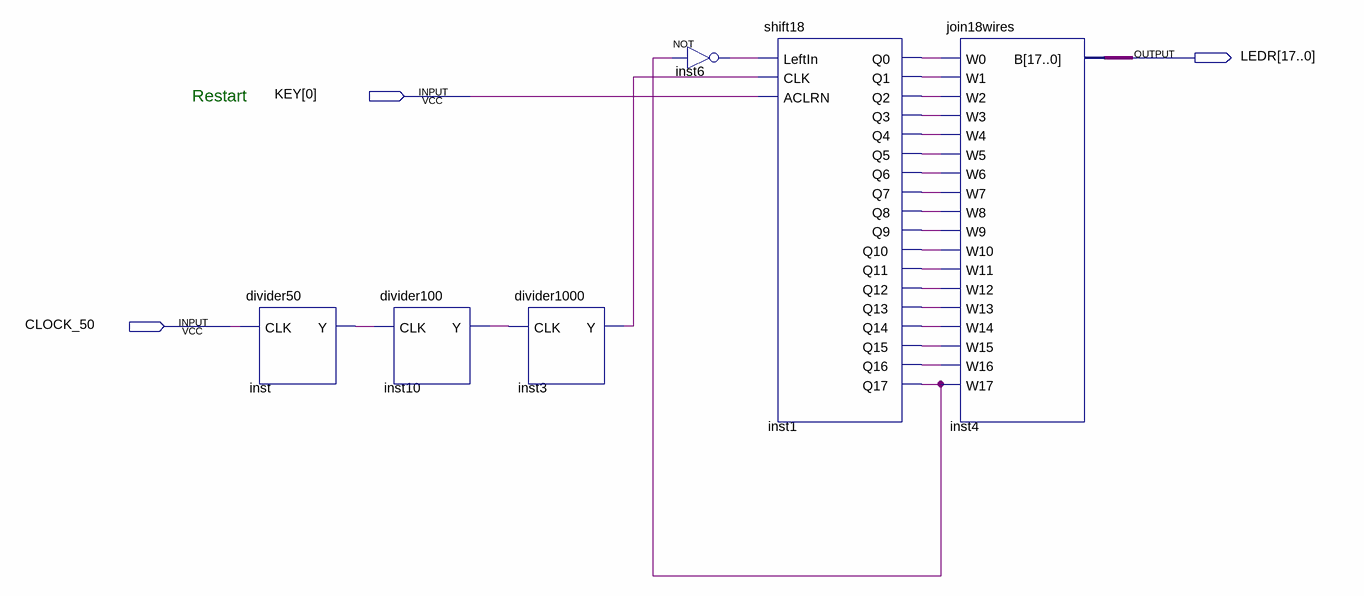
[diagram p0: schematic sheet]
// Quartus schematic test_shift18.bdf as structural Verilog: 6 symbols, 3 pins
module test_shift18 (
  input  [0:0] KEY,
  input  CLOCK_50,
  output [17:0] LEDR
);

  wire inst1_q0, inst1_q1, inst1_q2, inst1_q3, inst1_q4, inst1_q5, inst1_q6, inst1_q7, inst1_q8, inst1_q9,
       inst1_q10, inst1_q11, inst1_q12, inst1_q13, inst1_q14, inst1_q15, inst1_q16, inst1_q17, inst3_y,
       inst6_out, inst10_y, inst_y;

  divider50 inst (.CLK(CLOCK_50), .Y(inst_y));
  divider100 inst10 (.CLK(inst_y), .Y(inst10_y));
  divider1000 inst3 (.CLK(inst10_y), .Y(inst3_y));
  not inst6 (inst6_out, inst1_q17);
  shift18 inst1 (
    .LeftIn(inst6_out), .CLK(inst3_y), .ACLRN(KEY[0]), .Q0(inst1_q0), .Q1(inst1_q1), .Q2(inst1_q2),
    .Q3(inst1_q3), .Q4(inst1_q4), .Q5(inst1_q5), .Q6(inst1_q6), .Q7(inst1_q7), .Q8(inst1_q8), .Q9(inst1_q9),
    .Q10(inst1_q10), .Q11(inst1_q11), .Q12(inst1_q12), .Q13(inst1_q13), .Q14(inst1_q14), .Q15(inst1_q15),
    .Q16(inst1_q16), .Q17(inst1_q17));
  join18wires inst4 (
    .W0(inst1_q0), .W1(inst1_q1), .W2(inst1_q2), .W3(inst1_q3), .W4(inst1_q4), .W5(inst1_q5), .W6(inst1_q6),
    .W7(inst1_q7), .W8(inst1_q8), .W9(inst1_q9), .W10(inst1_q10), .W11(inst1_q11), .W12(inst1_q12),
    .W13(inst1_q13), .W14(inst1_q14), .W15(inst1_q15), .W16(inst1_q16), .W17(inst1_q17), .B(LEDR));

  // Notes on the sheet:
  //   Restart
endmodule
